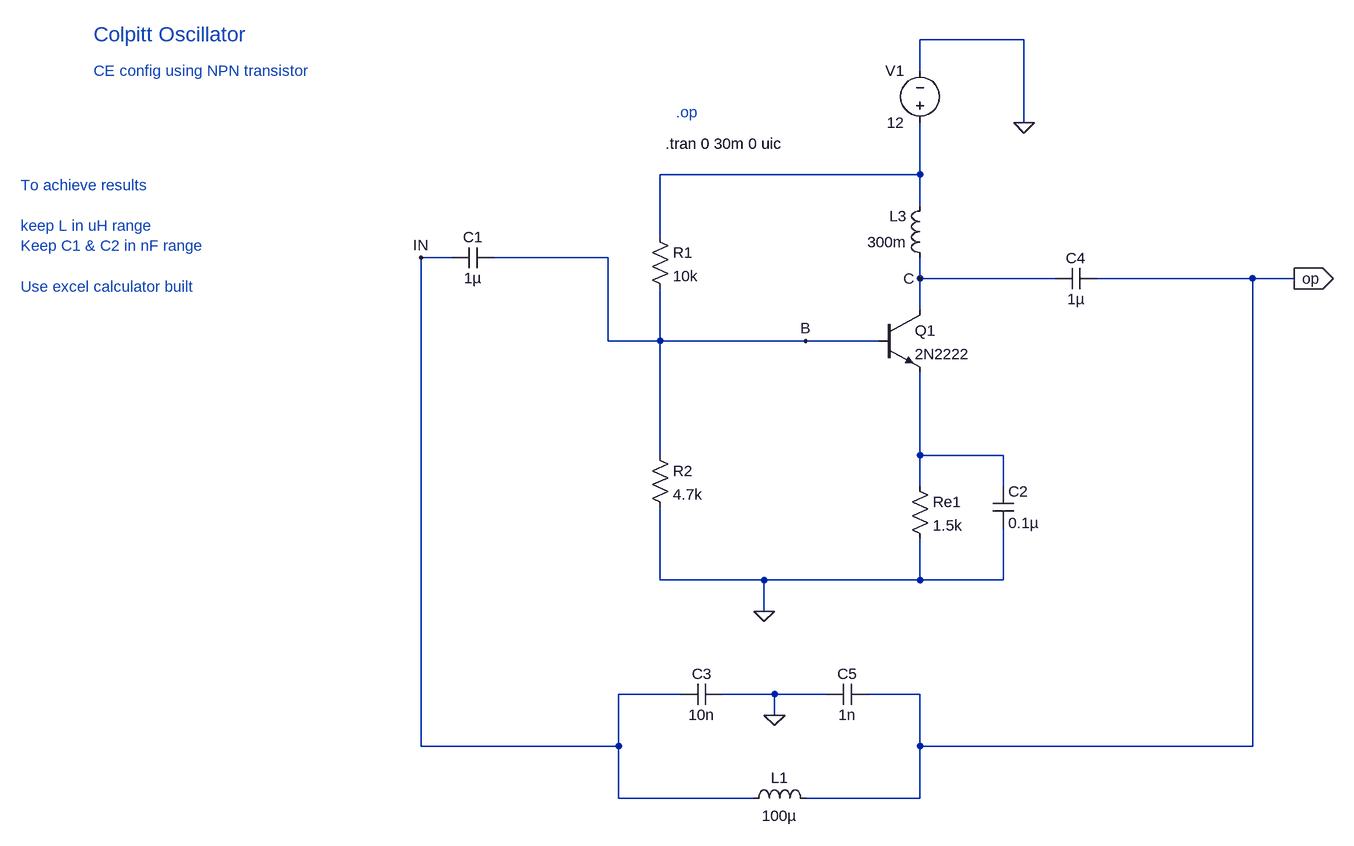
[diagram p0: schematic Colpitt_Oscillator.asc]
Colpitt_Oscillator.asc, the LTspice schematic file:
Version 4.1
SHEET 1 1080 1052
WIRE 576 -256 416 -256
WIRE 416 -208 416 -256
WIRE 576 -128 576 -256
WIRE 416 -48 416 -128
WIRE 416 -48 16 -48
WIRE 416 0 416 -48
WIRE 16 48 16 -48
WIRE -304 80 -352 80
WIRE -64 80 -240 80
WIRE 416 112 416 80
WIRE 624 112 416 112
WIRE 928 112 688 112
WIRE 992 112 928 112
WIRE 416 160 416 112
WIRE -64 208 -64 80
WIRE 16 208 16 128
WIRE 16 208 -64 208
WIRE 240 208 16 208
WIRE 352 208 240 208
WIRE 16 384 16 208
WIRE 416 384 416 256
WIRE 544 384 416 384
WIRE 416 432 416 384
WIRE 544 432 544 384
WIRE 16 576 16 464
WIRE 176 576 16 576
WIRE 416 576 416 512
WIRE 416 576 176 576
WIRE 544 576 544 496
WIRE 544 576 416 576
WIRE 176 624 176 576
WIRE 48 752 -48 752
WIRE 192 752 112 752
WIRE 272 752 192 752
WIRE 416 752 336 752
WIRE 192 784 192 752
WIRE -352 832 -352 80
WIRE -48 832 -48 752
WIRE -48 832 -352 832
WIRE 416 832 416 752
WIRE 928 832 928 112
WIRE 928 832 416 832
WIRE -48 912 -48 832
WIRE 160 912 -48 912
WIRE 416 912 416 832
WIRE 416 912 240 912
FLAG 576 -128 0
FLAG 176 624 0
FLAG 416 112 C
FLAG 240 208 B
FLAG -352 80 IN
FLAG 192 784 0
FLAG 992 112 op
IOPIN 992 112 Out
SYMBOL npn 352 160 R0
SYMATTR InstName Q1
SYMATTR Value 2N2222
SYMBOL voltage 416 -112 R180
WINDOW 0 24 96 Left 2
WINDOW 3 24 16 Left 2
WINDOW 123 0 0 Left 0
WINDOW 39 0 0 Left 0
SYMATTR InstName V1
SYMATTR Value 12
SYMBOL res 400 416 R0
SYMATTR InstName Re1
SYMATTR Value 1.5k
SYMBOL res 0 32 R0
SYMATTR InstName R1
SYMATTR Value 10k
SYMBOL res 0 368 R0
SYMATTR InstName R2
SYMATTR Value 4.7k
SYMBOL cap -240 64 R90
WINDOW 0 0 32 VBottom 2
WINDOW 3 32 32 VTop 2
SYMATTR InstName C1
SYMATTR Value 1µ
SYMBOL cap 528 432 R0
SYMATTR InstName C2
SYMATTR Value 0.1µ
SYMBOL cap 688 96 R90
WINDOW 0 0 32 VBottom 2
WINDOW 3 32 32 VTop 2
SYMATTR InstName C4
SYMATTR Value 1µ
SYMBOL ind 432 96 R180
WINDOW 0 36 80 Left 2
WINDOW 3 36 40 Left 2
SYMATTR InstName L3
SYMATTR Value 300m
SYMBOL ind 144 928 R270
WINDOW 0 32 56 VTop 2
WINDOW 3 5 56 VBottom 2
SYMATTR InstName L1
SYMATTR Value 100µ
SYMBOL cap 112 736 R90
WINDOW 0 0 32 VBottom 2
WINDOW 3 32 32 VTop 2
SYMATTR InstName C3
SYMATTR Value 10n
SYMBOL cap 336 736 R90
WINDOW 0 0 32 VBottom 2
WINDOW 3 32 32 VTop 2
SYMATTR InstName C5
SYMATTR Value 1n
TEXT -856 -208 Left 2 ;CE config using NPN transistor
TEXT 24 -96 Left 2 !.tran 0 30m 0 uic
TEXT 40 -144 Left 2 ;.op
TEXT -856 -264 Left 3 ;Colpitt Oscillator
TEXT -968 -32 Left 2 ;To achieve results \n \nkeep L in uH range \nKeep C1 & C2 in nF range \n \nUse excel calculator built

The netlist it stands for:
* Colpitt_Oscillator.asc
Q1 C B N002 0 2N2222
V1 N001 0 12
Re1 N002 0 1.5k
R1 N001 B 10k
R2 B 0 4.7k
C1 B IN 1µ
C2 N002 0 0.1µ
C4 op C 1µ
L3 C N001 300m
L1 IN op 100µ
C3 0 IN 10n
C5 op 0 1n
.model NPN NPN
.model PNP PNP
.lib standard.bjt
* CE config using NPN transistor
.tran 0 30m 0 uic
* .op
* Colpitt Oscillator
* To achieve results
* keep L in uH range
* Keep C1 & C2 in nF range
* Use excel calculator built
.backanno
.end